# Altium schematic sheet I2C_schematic.SchDoc
size A; SheetNumber: 1; SheetTotal: 1
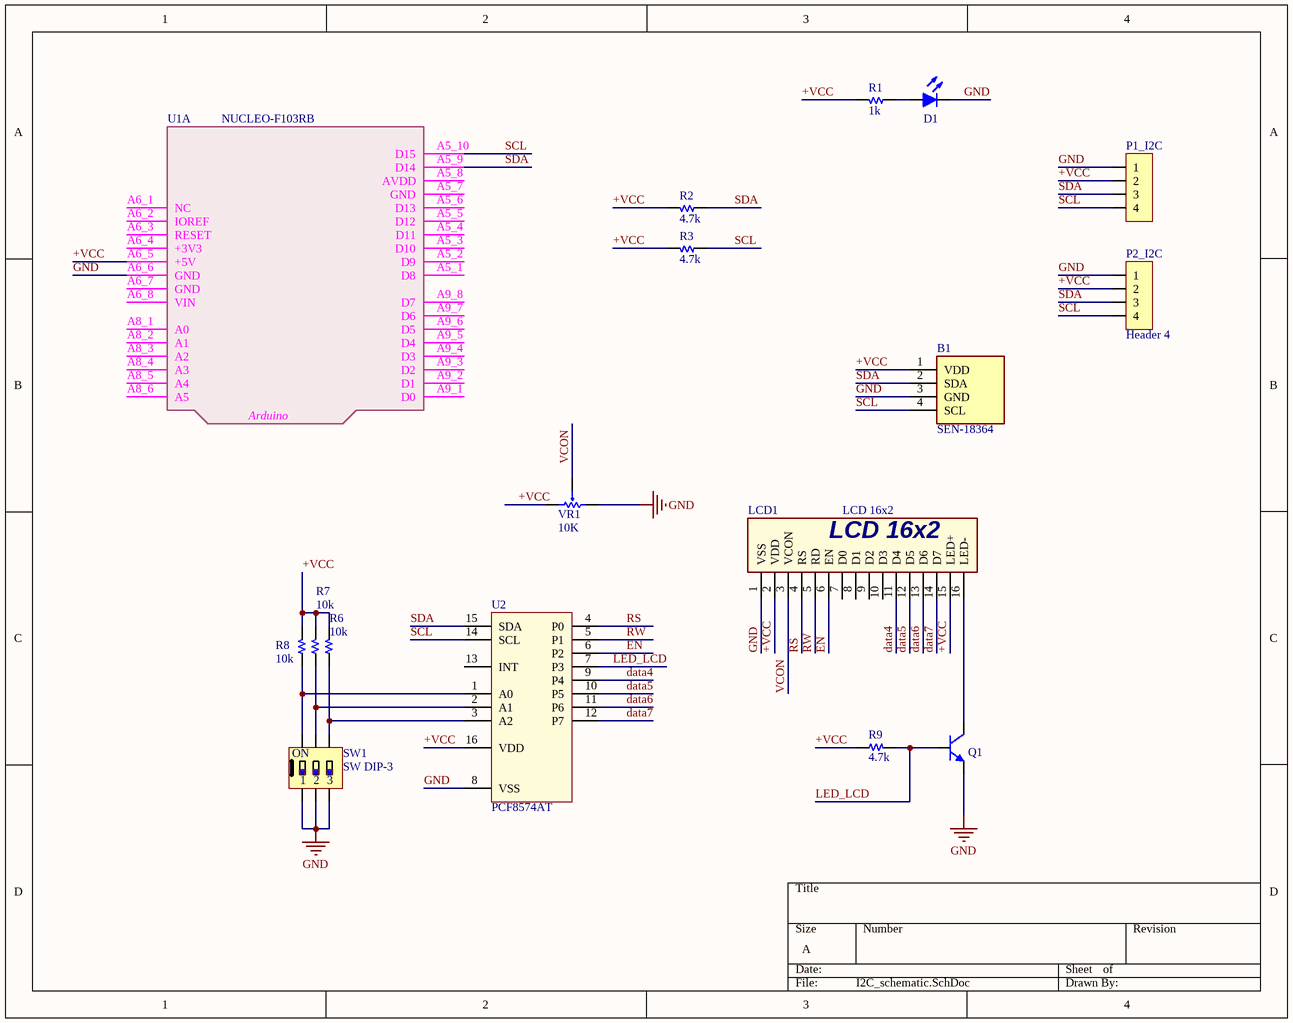
[diagram p0: I2C_schematic.SchDoc]

## Parts
B1  SEN-18364  [SEN18364]
D1  Led  [LED 3MM - red]  (value not drawn)
LCD1  LCD 16x2  [LCD 1602B]
P1_I2C  (no value)  [HDR/Header/4/2mm/BOX]
P2_I2C  Header 4  [HDR/Header/4/2mm/BOX]
Q1  Transistor NPN  [TO-92/W100]  (value not drawn)
R1  1k  [R 1/4W/300]
R2  4.7k  [R 1/4W/300]
R3  4.7k  [R 1/4W/300]
R6  10k  [R 1/4W/300]
R7  10k  [R 1/4W/300]
R8  10k  [R 1/4W/300]
R9  4.7k  [R 1/4W/300]
SW1  SW DIP-3  [SW/DIP3]
U1  NUCLEO-F103RB  [NUCLEO]  (part A of 3)
U2  PCF8574AT  [DIP16]
VR1  10K  [R VAR A 3D]

## Nets
GND: B1.3(GND) D1.2(K) LCD1.1(VSS) P1_I2C.1 P2_I2C.1 Q1.2(E) SW1.1 SW1.2 SW1.3 U1.A6_6(GND) U2.8(VSS) VR1.3
+VCC: B1.1(VDD) LCD1.2(VDD) LCD1.15(LED+) P1_I2C.2 P2_I2C.2 R1.2 R2.2 R3.2 R6.2 R7.2 R8.2 R9.1 U1.A6_5(+5V) U2.16(VDD) VR1.1
data4: LCD1.11(D4) U2.9(P4)
data5: LCD1.12(D5) U2.10(P5)
data6: LCD1.13(D6) U2.11(P6)
data7: LCD1.14(D7) U2.12(P7)
EN: LCD1.6(EN) U2.6(P2)
LED_LCD: Q1.1(B) R9.2 U2.7(P3)
RS: LCD1.4(RS) U2.4(P0)
RW: LCD1.5(RD) U2.5(P1)
SCL: B1.4(SCL) P1_I2C.4 P2_I2C.4 R3.1 U1.A5_10(D15) U2.14(SCL)
SDA: B1.2(SDA) P1_I2C.3 P2_I2C.3 R2.1 U1.A5_9(D14) U2.15(SDA)
VCON: LCD1.3(VCON) VR1.2
NetD1_1: D1.1(A) R1.1
NetLCD1_16: LCD1.16(LED-) Q1.3(C)
NetR6_1: R6.1 SW1.4 U2.3(A2)
NetR7_1: R7.1 SW1.5 U2.2(A1)
NetR8_1: R8.1 SW1.6 U2.1(A0)

Not connected (* = marked no-connect by the designer): LCD1 7(D0) 8(D1) 9(D2) 10(D3); U1 A5_1(D8) A5_2(D9) A5_3(D10) A5_4(D11) A5_5(D12) A5_6(D13) A5_7(GND) A5_8(AVDD) A6_1(NC) A6_2(IOREF) A6_3(RESET) A6_4(+3V3) A6_7(GND) A6_8(VIN) A8_1(A0) A8_2(A1) A8_3(A2) A8_4(A3) A8_5(A4) A8_6(A5) A9_1(D0) A9_2(D1) A9_3(D2) A9_4(D3) A9_5(D4) A9_6(D5) A9_7(D6) A9_8(D7); U2 13(INT)

## Notes on the sheet
- (in symbol NUCLEO-F103RB, part A) Arduino
- (in symbol SW DIP-3) ON

## Library data of the parts
B1 = SEN-18364: Multiple Function Sensor Modules Humidity and Temperature Sensor - DHT20; Manufacturer_Name: SparkFun; Geometry.Height: 16.3mm; Manufacturer_Part_Number: SEN-18364; Mouser Part Number: 474-SEN-18364; Mouser Price/Stock: https://www.mouser.co.uk/ProductDetail/SparkFun/SEN-18364?qs=QNEnbhJQKvbVltiDzPDFyg%3D%3D; Arrow Part Number: *; Arrow Price/Stock: *; Datasheet Link: https://cdn.sparkfun.com/assets/8/a/1/5/0/DHT20.pdf
D1 = Led: Typical LED
LCD1 = LCD 16x2: Character LCD 16x2
P1_I2C P2_I2C = Header 4: Header, 4-Pin
Q1 = Transistor NPN: NPN Bipolar Transistor; pin to pad: 1>3 2>1 3>2
R1-R3 R6-R9 = Resistor
U1 = NUCLEO-F103RB: STM32F103RB, mbed-Enabled Development Nucleo-64 STM32F1 ARM® Cortex®-M3 MCU 32-Bit Embedded Evaluation Board; Manufacturer: STMicroelectronics; Manufacturer Product Number: NUCLEO-F103RB; BRAND: STMicroelectronics; PART NO: NUCLEO-F103RB; STOCK CODE: 497-14362-ND; SUPPLIER: digi-key; TYPE: EVAL BRD
U2 = PCF8574AT: Remote 8-bit I/O expander for I2C-bus with interrupt; PART NO: PCF8574AT/3; BRAND: NXP; PACKAGE: SO16; TYPE: SMD
VR1 = Resistor Variable